# Altium schematic sheet BYPASS_RELAY.SchDoc
size A4; SheetNumber: 6; SheetTotal: 7
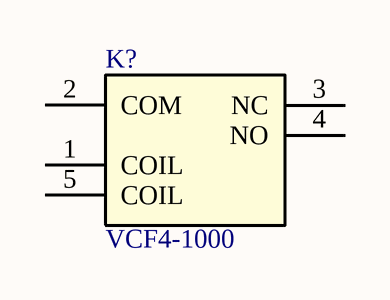
[diagram p0: BYPASS_RELAY.SchDoc]

## Parts
K?  VCF4-1000  [VCF4-1000-Footprint-1]

## Nets

Not connected (* = marked no-connect by the designer): K? 1(COIL) 2(COM) 3(NC) 4(NO) 5(COIL)

## Library data of the parts
K? = CMP-008-00002-2: Relay Socket, 1 Contact(s); RoHS Compliant: Yes